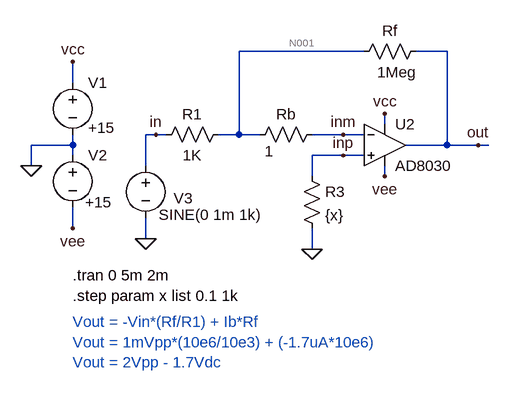
[diagram p0: schematic AD8030 bias current.asc]
AD8030 bias current.asc, the LTspice schematic file:
Version 4
SHEET 1 880 680
WIRE 320 -64 128 -64
WIRE 448 -64 400 -64
WIRE -128 -16 -128 -48
WIRE 352 48 352 32
WIRE 0 64 -16 64
WIRE 16 64 0 64
WIRE 128 64 128 -64
WIRE 128 64 96 64
WIRE 160 64 128 64
WIRE 288 64 240 64
WIRE 320 64 288 64
WIRE -128 80 -128 64
WIRE -128 80 -192 80
WIRE 448 80 448 -64
WIRE 448 80 384 80
WIRE 496 80 448 80
WIRE 512 80 496 80
WIRE -128 96 -128 80
WIRE 288 96 240 96
WIRE 320 96 288 96
WIRE -192 112 -192 80
WIRE -16 112 -16 64
WIRE 240 128 240 96
WIRE 352 128 352 112
WIRE -128 208 -128 176
WIRE -16 224 -16 192
WIRE 240 240 240 208
FLAG -192 112 0
FLAG -128 -48 vcc
FLAG -128 208 vee
FLAG -16 224 0
FLAG 0 64 in
FLAG 352 128 vee
FLAG 352 32 vcc
FLAG 496 80 out
FLAG 240 240 0
FLAG 288 64 inm
FLAG 288 96 inp
SYMBOL voltage -128 -32 R0
WINDOW 3 24 85 Left 2
WINDOW 123 0 0 Left 0
WINDOW 39 0 0 Left 0
SYMATTR Value +15
SYMATTR InstName V1
SYMBOL voltage -128 80 R0
WINDOW 3 19 88 Left 2
WINDOW 123 0 0 Left 0
WINDOW 39 0 0 Left 0
SYMATTR Value +15
SYMATTR InstName V2
SYMBOL voltage -16 96 R0
WINDOW 0 43 66 Left 2
WINDOW 3 20 91 Left 2
WINDOW 123 0 0 Left 0
WINDOW 39 0 0 Left 0
SYMATTR InstName V3
SYMATTR Value SINE(0 1m 1k)
SYMBOL res 416 -80 R90
WINDOW 0 0 56 VBottom 2
WINDOW 3 32 45 VTop 2
SYMATTR InstName Rf
SYMATTR Value 1Meg
SYMBOL res 112 48 R90
WINDOW 0 0 56 VBottom 2
WINDOW 3 32 56 VTop 2
SYMATTR InstName R1
SYMATTR Value 1K
SYMBOL OpAmps\\AD8030 352 16 R0
SYMATTR InstName U2
SYMBOL res 256 48 R90
WINDOW 0 0 56 VBottom 2
WINDOW 3 26 82 VTop 2
SYMATTR InstName Rb
SYMATTR Value 1
SYMBOL res 224 112 R0
SYMATTR InstName R3
SYMATTR Value {x}
TEXT -128 280 Left 2 !.tran 0 5m 2m
TEXT -128 352 Left 2 ;Vout = -Vin*(Rf/R1) + Ib*Rf\nVout = 1mVpp*(10e6/10e3) + (-1.7uA*10e6)\nVout = 2Vpp - 1.7Vdc
TEXT -128 312 Left 2 !.step param x list 0.1 1k

The netlist it stands for:
* AD8030 bias current.asc
V1 vcc 0 +15
V2 0 vee +15
V3 in 0 SINE(0 1m 1k)
Rf out N001 1Meg
R1 N001 in 1K
XU2 inp inm vcc vee out AD8040  ; AD8030, pins In+ In- V+ V- OUT
Rb inm N001 1
R3 inp 0 {x}
.tran 0 5m 2m
* Vout = -Vin*(Rf/R1) + Ib*Rf
* Vout = 1mVpp*(10e6/10e3) + (-1.7uA*10e6)
* Vout = 2Vpp - 1.7Vdc
.step param x list 0.1 1k
.lib ADI.lib
.backanno
.end

* Results of the author's LTspice run, read from the files saved beside the schematic
* Operating Point (first step), zero values left out:
*   x = 100 m
*   V(vcc) = 15 V
*   V(vee) = -15 V
*   V(out) = -1.695 V
*   V(n001) = 5.327 µV
*   V(inm) = 7.027 µV
*   V(inp) = 170 nV
*   I(Rf) = -1.695 µA
*   I(R1) = 5.327 nA
*   I(Rb) = 1.7 µA
*   I(R3) = 1.7 µA
*   I(V1) = -1.423 mA
*   I(V2) = -1.421 mA
*   I(V3) = 5.327 nA
*   Ix(u2:1) = -1.7 µA
*   Ix(u2:2) = -1.7 µA
*   Ix(u2:3) = 1.423 mA
*   Ix(u2:4) = -1.421 mA
*   Ix(u2:5) = 1.695 µA
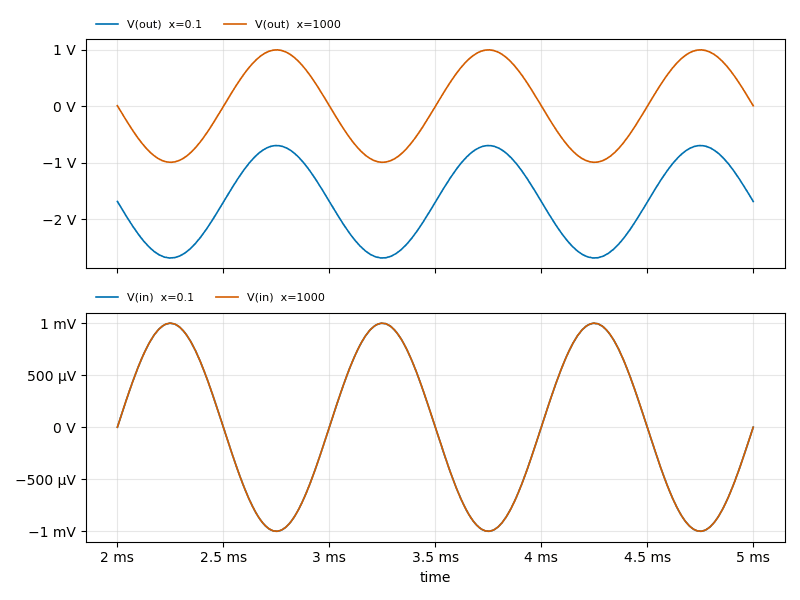
[diagram p1: Transient Analysis of AD8030 bias current.asc, plotted from the saved traces]
* Transient Analysis, 2 runs:
*   V(out) [x=0.1]: min -2.69 V, max -698.9 mV, average -1.695 V, rms 1.836 V, last -1.688 V
*   V(out) [x=1000]: min -995.7 mV, max 995.5 mV, average -1.408 µV, rms 704.1 mV, last 6.36 mV
*   V(in) [x=0.1]: min -1 mV, max 999.8 µV, average -173.3 nV, rms 709.2 µV, last 0 V
*   V(in) [x=1000]: min -999.6 µV, max 1 mV, average 0 V, rms 707.1 µV, last 0 V